# EAGLE design Gaga_Soundsystem (EAGLE 6.4)
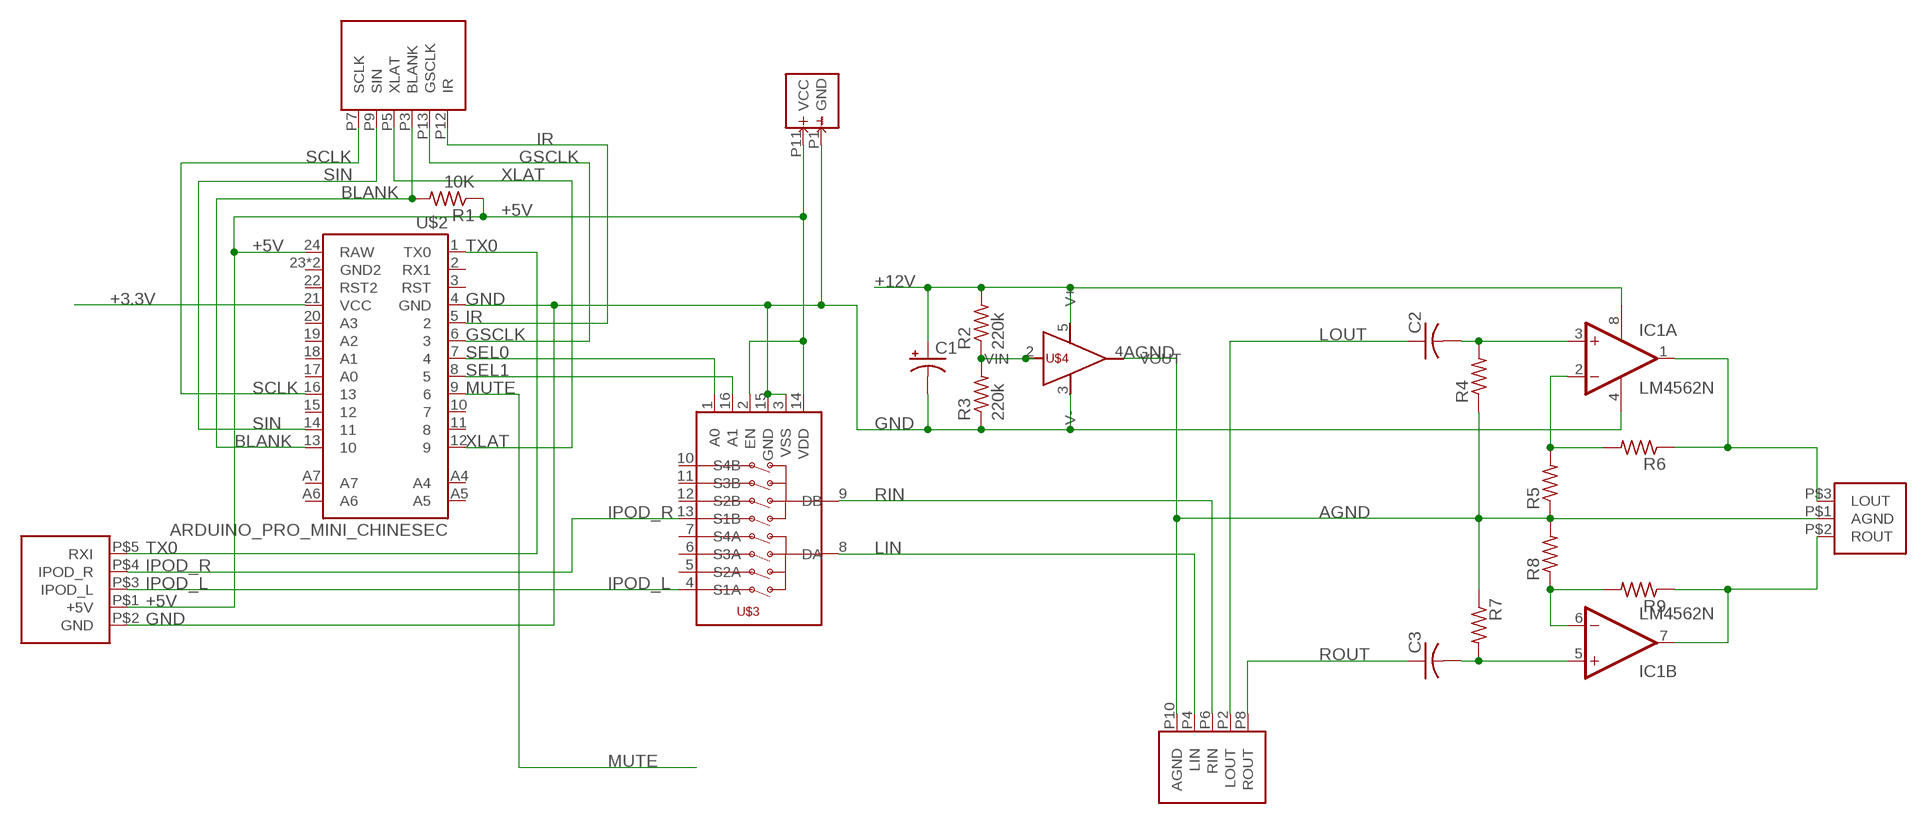
[diagram p0: schematic, sheet 1]

## Parts
C1  CPOL-USE5-13  [E5-13]
C2  C-US075-063X106  [C075-063X106]
C3  C-US075-063X106  [C075-063X106]
IC1  LM4562N  [DIL08]
R1  10K  R-US_0207/7  [0207/7]
R2  220k  R-US_0207/7  [0207/7]
R3  220k  R-US_0207/7  [0207/7]
R4  R-US_0207/7  [0207/7]
R5  R-US_0207/7  [0207/7]
R6  R-US_0207/7  [0207/7]
R7  R-US_0207/7  [0207/7]
R8  R-US_0207/7  [0207/7]
R9  R-US_0207/7  [0207/7]
U$1  OTHERSIDE  [OTHERSIDE]
U$2  ARDUINO_PRO_MINI_CHINESEC  [ARDUINO_PRO_MINI_CHINESE]
U$3  ADG709  [TSSOP16]
U$4  BUF634  [TO220]
U$5  IPODCON  [IPODCON]
U$6  AUDIOOUT  [AUDIOOUT]

## Nets
+3.3V: U$2.21(VCC)
+5V: R1.1 U$1.P11(VCC) U$2.24(RAW) U$3.2(EN) U$3.14(VDD) U$5.P$1(+5V)
+12V: C1.+ IC1.8(P:V+) R2.2 U$4.5(V+)
AGND: R4.1 R5.1 R7.1 R8.2 U$1.P10(AGND) U$4.4(VOUT) U$6.P$1(AGND)
BLANK: R1.2 U$1.P3(BLANK) U$2.13
GND: C1.- IC1.4(P:V-) R3.1 U$1.P1(GND) U$2.4(GND) U$3.3(VSS) U$3.15(GND) U$4.3(V-) U$5.P$2(GND)
GSCLK: U$1.P13(GSCLK) U$2.6
IPOD_L: U$3.4(S1A) U$5.P$3(IPOD_L)
IPOD_R: U$3.13(S1B) U$5.P$4(IPOD_R)
IR: U$1.P12(IR) U$2.5
LIN: U$1.P4(LIN) U$3.8(DA)
LOUT: C2.1 U$1.P2(LOUT)
MUTE: U$2.9
N$1: R2.1 R3.2 U$4.2(VIN)
N$8: IC1.2(A:-IN) R5.2 R6.2
N$9: C2.2 IC1.3(A:+IN) R4.2
N$10: IC1.6(B:-IN) R8.1 R9.2
N$13: IC1.1(A:OUT) R6.1 U$6.P$3(LOUT)
N$14: C3.2 IC1.5(B:+IN) R7.2
N$15: IC1.7(B:OUT) R9.1 U$6.P$2(ROUT)
RIN: U$1.P6(RIN) U$3.9(DB)
ROUT: C3.1 U$1.P8(ROUT)
SCLK: U$1.P7(SCLK) U$2.16
SEL0: U$2.7 U$3.1(A0)
SEL1: U$2.8 U$3.16(A1)
SIN: U$1.P9(SIN) U$2.14
TX0: U$2.1(TX0) U$5.P$5(RXI)
XLAT: U$1.P5(XLAT) U$2.12
Unconnected: U$2.2(RX1) U$2.3(RST) U$2.10 U$2.11 U$2.15 U$2.17(A0) U$2.18(A1) U$2.19(A2) U$2.20(A3) U$2.22(RST2) U$2.23(GND2) U$2.A4 U$2.A5 U$2.A6 U$2.A7 U$2.GND2 U$3.5(S2A) U$3.6(S3A) U$3.7(S4A) U$3.10(S4B) U$3.11(S3B) U$3.12(S2B)

## Library data of the parts
C1 = resistor:CPOL-US: POLARIZED CAPACITOR, American symbol
C2 C3 = resistor:C-US: CAPACITOR, American symbol
IC1 = LM4562:LM4562: OP AMP also LM158; LM258; LM2904 Source: http://cache.national.com/ds/LM/LM158.pdf
R1-R9 = resistor:R-US_: RESISTOR, American symbol
U$1 = connector:OTHERSIDE
U$2 = SparkFun-Boards:ARDUINO_PRO_MINI_CHINESE
U$3 = ADG709:ADG709
U$4 = BUF634:BUF634
U$5 = connector:IPODCON
U$6 = connector:AUDIOOUT

## Net classes
0 default: clearance 0.355 mm

## Board
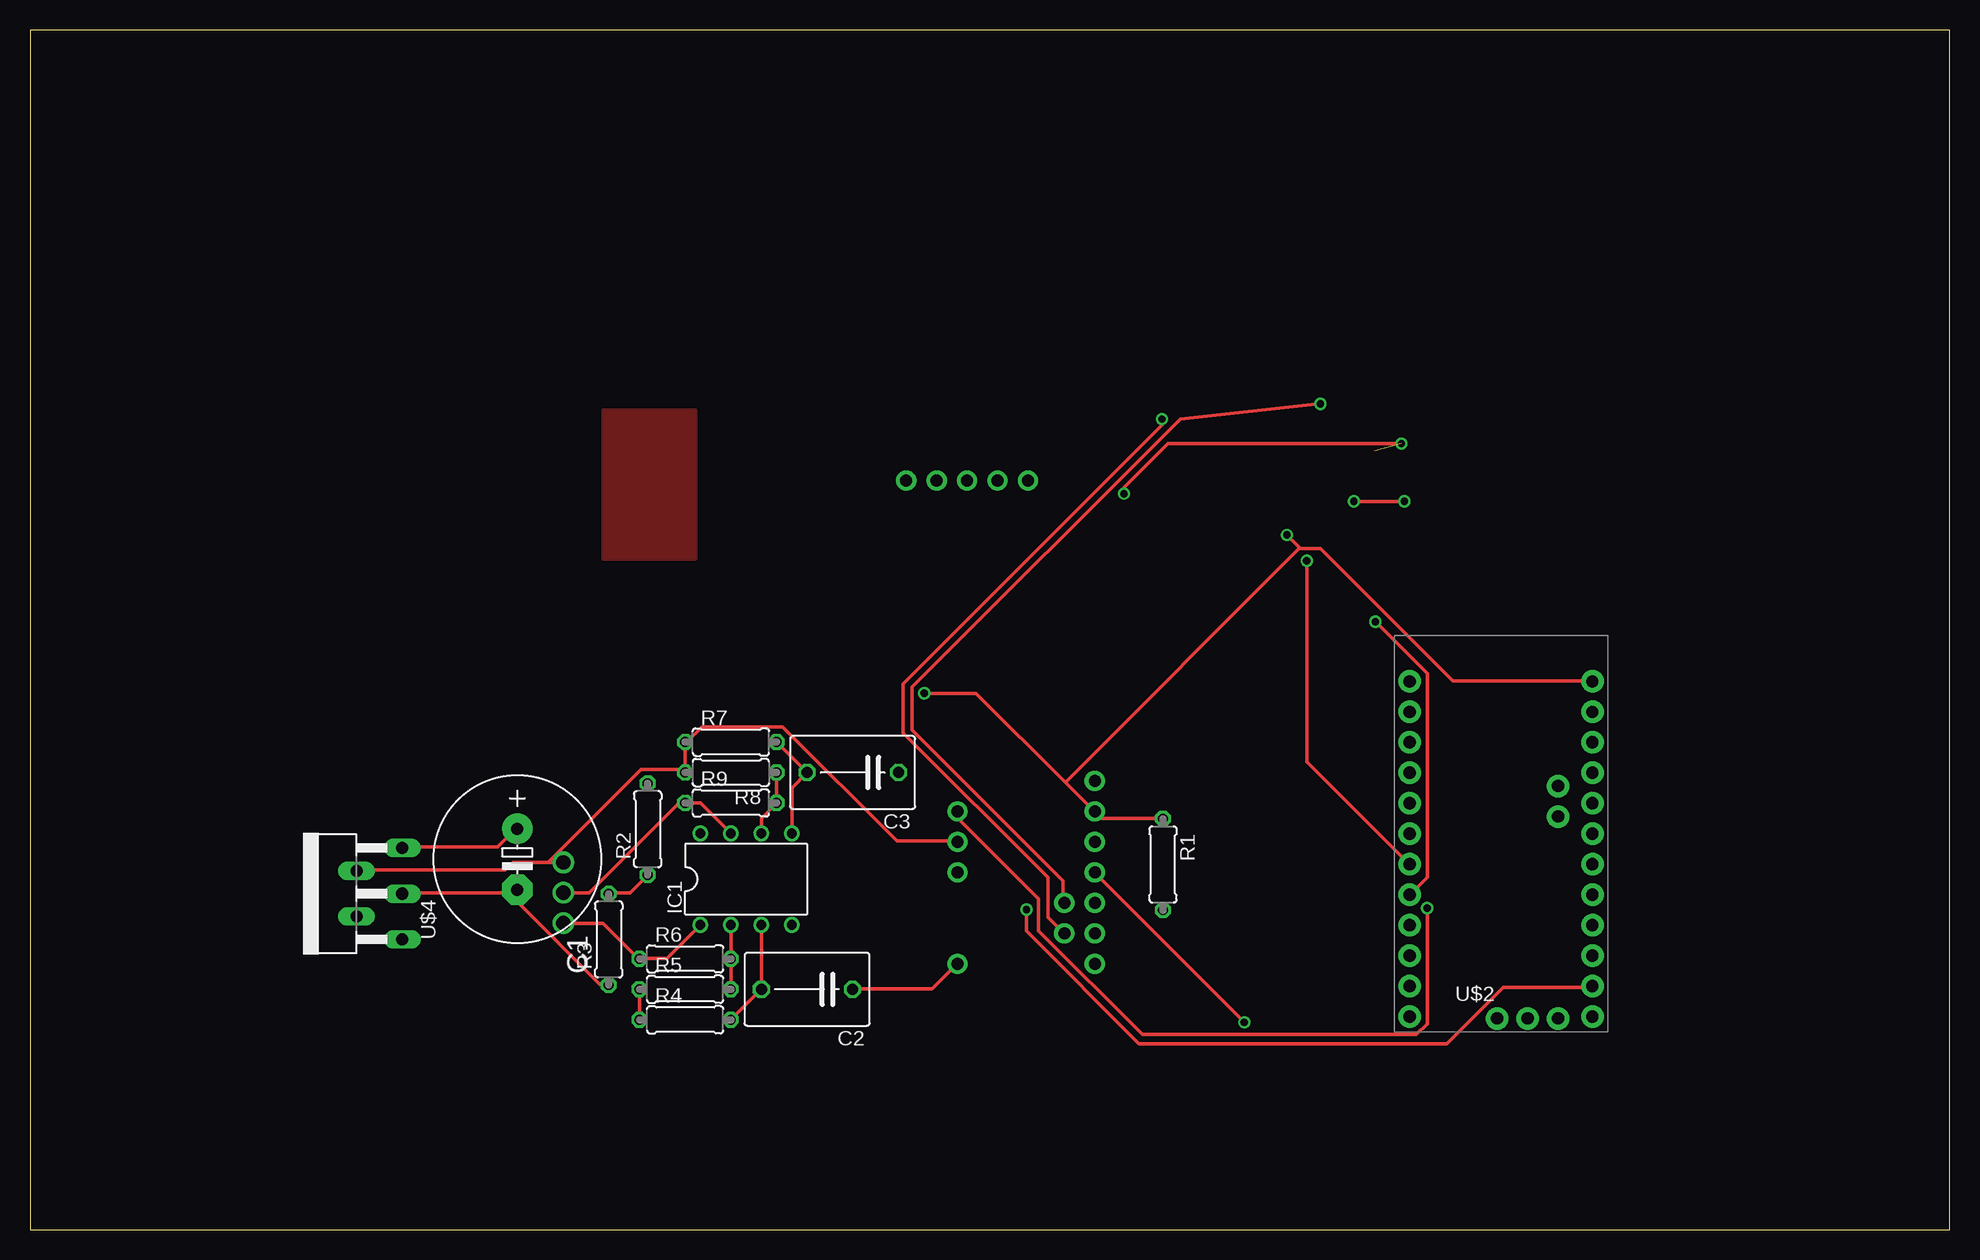
[diagram p1: board, top side]
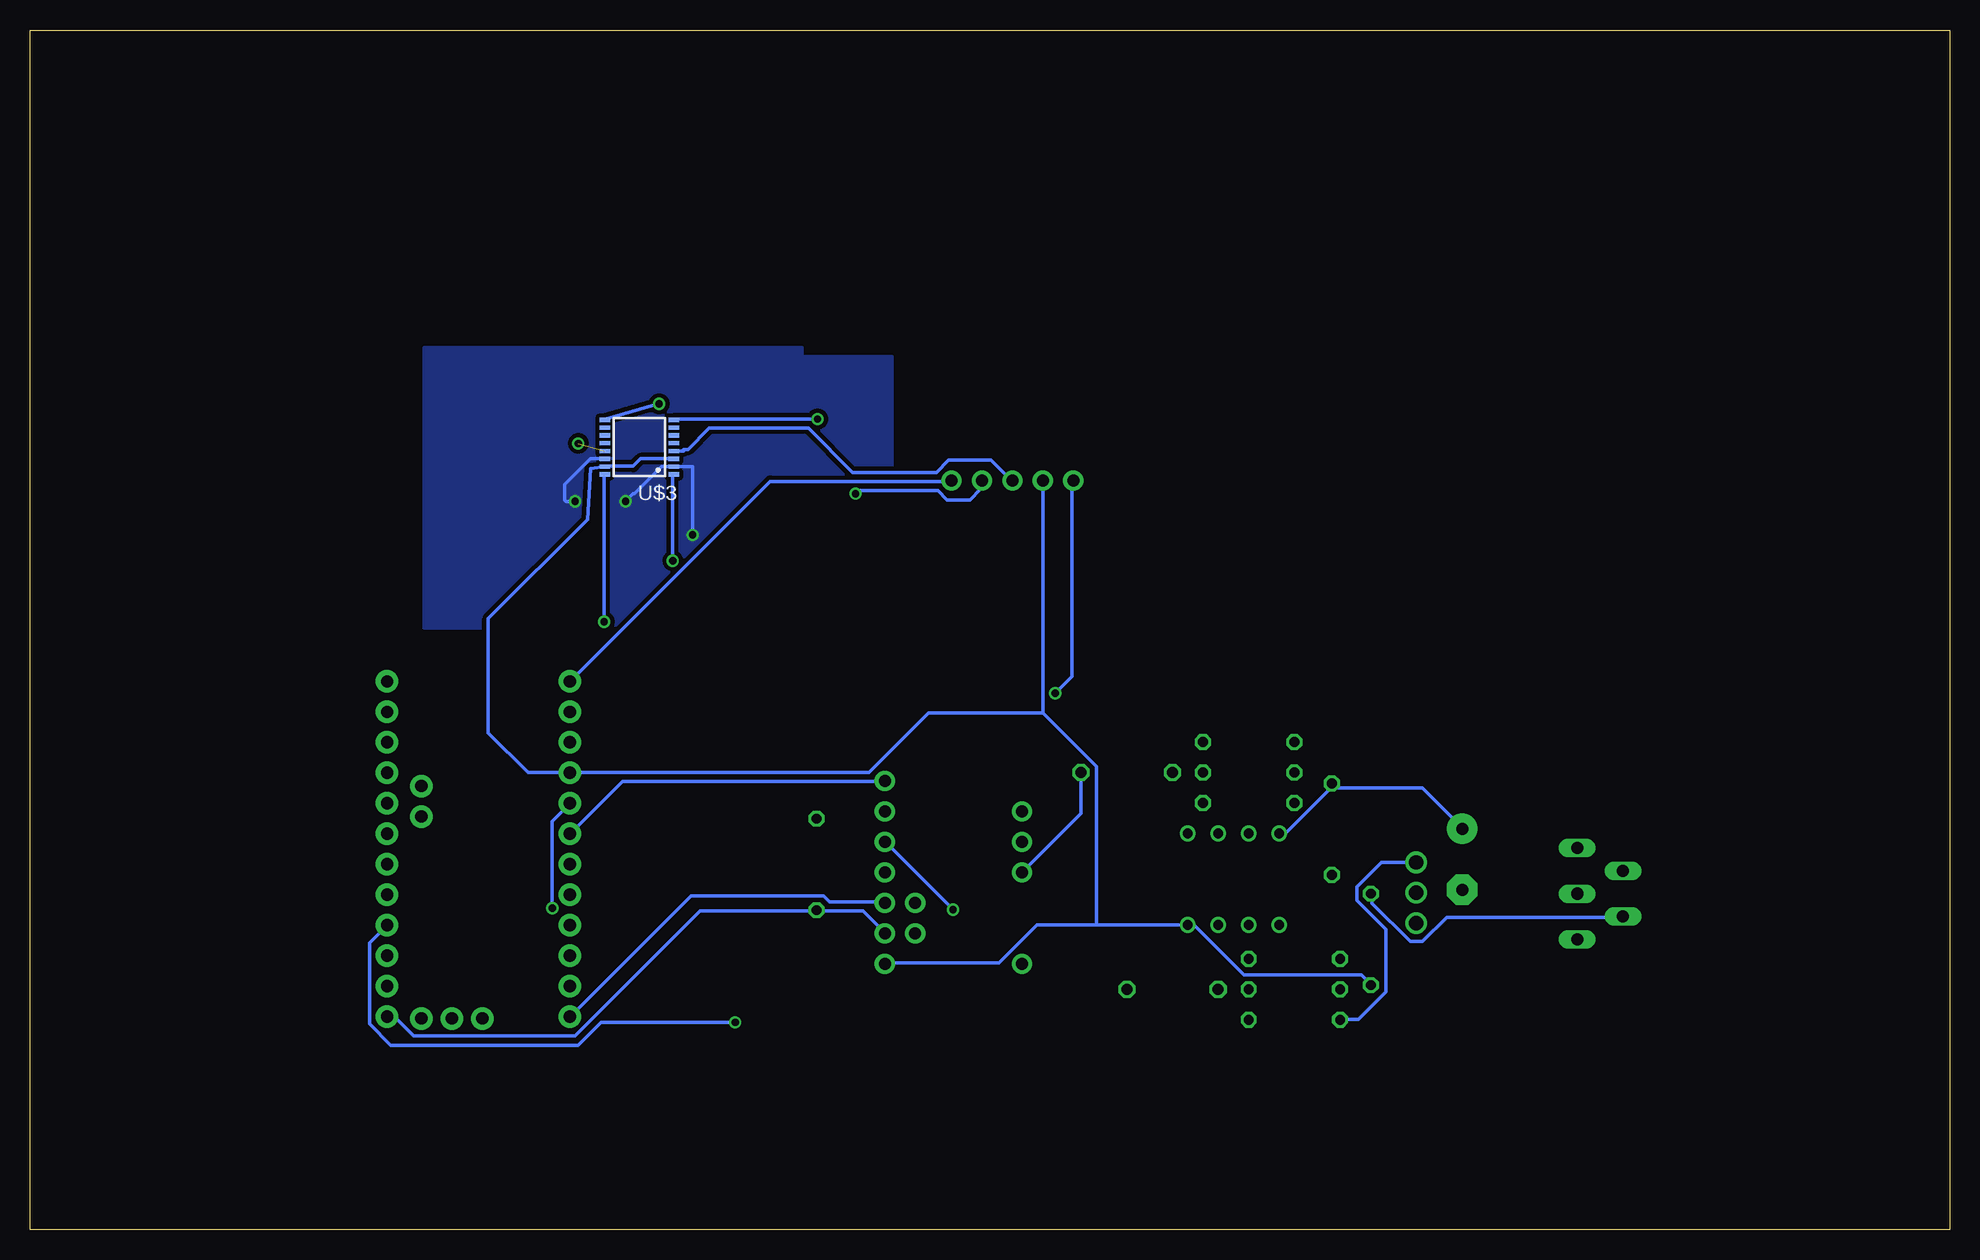
[diagram p2: board, bottom side, seen from below]

Size 160 x 100 mm. Coordinates in mm from the lower left corner, seen from the top.
Outline: 0,0 160,0 160,100 0,100 0,0
Copper layers (1*16): Top 0.035mm / dielectric 1.5mm / Bottom 0.035mm
Design rules "default *": minimum track width 12mil, minimum drill 24mil, track to track 12mil, track to pad 8mil, pad to pad 8mil, via to via 8mil, smd to smd 8mil, copper to edge 40mil, drill to drill 8mil, minimum pad ring 10mil, minimum via ring 8mil, stop-mask expansion 4mil, vias tented up to drill 0mil, thermal gap 10mil

### Footprints (pad centres in the part's own frame; a part is rotated, then mirrored left to right if it is on the bottom)
E5-13 = drill 1.016 pad 2.54: + -2.54,0 | drill 1.016 pad 2.54 octagon: - 2.54,0
C075-063X106 = drill 0.914 octagon: 1 -3.81,0; 2 3.81,0
DIL08 = drill 0.813 pad 1.27: 1 -3.81,-3.81; 2 -1.27,-3.81; 3 1.27,-3.81; 4 3.81,-3.81; 5 3.81,3.81; 6 1.27,3.81; 7 -1.27,3.81; 8 -3.81,3.81
0207/7 = drill 0.813 octagon: 1 -3.81,0; 2 3.81,0
OTHERSIDE = drill 1 pad 1.676: P1 1.27,10.16; P2 1.27,-1.27; P3 -1.27,10.16; P4 -1.27,7.62; P5 -3.81,10.16; P6 -3.81,7.62; P7 -6.35,10.16; P8 -6.35,-1.27; P9 -8.89,10.16; P10 -8.89,-1.27; P11 -11.43,10.16; P12 -11.43,-1.27; P13 -13.97,10.16
ARDUINO_PRO_MINI_CHINESE = drill 1.016 pad 1.88: 1 -7.62,12.7; 2 -7.62,10.16; 3 -7.62,7.62; 4 -7.62,5.08; 5 -7.62,2.54; 6 -7.62,0; 7 -7.62,-2.54; 8 -7.62,-5.08; 9 -7.62,-7.62; 10 -7.62,-10.16; 11 -7.62,-12.7; 12 -7.62,-15.24; 13 7.62,-15.24; 14 7.62,-12.7; 15 7.62,-10.16; 16 7.62,-7.62; 17 7.62,-5.08; 18 7.62,-2.54; 19 7.62,0; 20 7.62,2.54; 21 7.62,5.08; 22 7.62,7.62; 23 7.62,10.16; 24 7.62,12.7; A4 4.763,1.429; A5 4.763,3.969; A6 2.223,-15.399; A7 4.763,-15.399; GND2 -0.318,-15.399
TSSOP16 = smd 0.9 x 0.35: 1 -2.875,2.275; 2 -2.875,1.625; 3 -2.875,0.975; 4 -2.875,0.325; 5 -2.875,-0.325; 6 -2.875,-0.975; 7 -2.875,-1.625; 8 -2.875,-2.275; 9 2.875,-2.275; 10 2.875,-1.625; 11 2.875,-0.975; 12 2.875,-0.325; 13 2.875,0.325; 14 2.875,0.975; 15 2.875,1.625; 16 2.875,2.275
TO220 = drill 1.016 long: 1 -3.81,-8.255; 2 -1.905,-4.445; 3 0,-8.255; 4 1.905,-4.445; 5 3.81,-8.255
IPODCON = drill 1 pad 1.676: P$1 -5.08,0; P$2 -2.54,0; P$3 0,0; P$4 2.54,0; P$5 5.08,0
AUDIOOUT = drill 1.2: P$1 -2.54,0; P$2 0,0; P$3 2.54,0

### Placement (x,y rotation side)
C1  40.62,30.86 270 top
C2  64.77,20.02 180 top
C3  68.58,38.1 180 top
IC1  59.69,29.21 0 top
R1  94.44,30.43 270 top
R2  51.48,33.38 90 top
R3  48.23,24.19 90 top
R4  54.61,17.48 0 top
R5  54.61,20.02 0 top
R6  54.61,22.57 0 top
R7  58.42,40.64 0 top
R8  58.42,38.1 180 top
R9  58.42,35.56 0 top
U$1  78.59,23.42 270 top
U$2  122.61,33 0 top
U$3  109.21,65.23 180 bottom
U$4  22.77,28 90 top
U$5  78.12,62.44 0 top
U$6  44.45,28.07 270 top

### Tracks (layer width: path | path; a pad name or v marks a point on that pad's centre or on a via)
+5V  (via drill 0.6, 0.61)
  Top 0.305: R1.1 94.36,34.29 89.28,34.29 88.77,34.8 U$1.P11 88.65,34.92 86.3,37.27 | v74.55,44.7 78.87,44.7 86.3,37.27 | 105.79,56.77 107.57,56.77 118.62,45.72 130.18,45.72 U$2.24 | 86.3,37.27 105.79,56.77 | v104.78,57.91 105.79,56.9 105.79,56.77 | v110.36,60.71 v114.55,60.71
  Bottom 0.305: v74.55,44.7 73.15,46.1 73.15,62.36 U$5.P$1 | v104.78,57.91 104.78,63.6 U$3.2 107.34,63.6 109.6,61.34 109.73,61.34 v110.36,60.71 | U$3.14 113.29,64.25 115.44,62.1 115.44,60.83 115.32,60.71 v114.55,60.71
  pour Bottom: 95.38,72.77 88.14,72.77 88.14,50.16 127.13,50.16 127.13,73.53 95.63,73.53 95.63,72.77
+12V
  Top 0.305: U$4.5 31.11,31.88 38.99,31.88 40.51,33.4 C1.+
  Bottom 0.305: IC1.8 55.37,33.02 51.56,36.83 51.56,37.08 R2.2 51.44,36.83 43.94,36.83 40.64,33.53 C1.+
AGND
  Top 0.305: U$1.P10 77.22,32.38 72.26,32.38 62.74,41.91 56.01,41.91 54.74,40.64 R7.1 R8.2 54.48,38.35 50.93,38.35 43.31,30.73 43.31,30.61 | R5.1 R4.1 | U$6.P$1 43.31,30.61 | 43.31,30.61 40.26,30.61 39.62,29.97 27.3,29.97 U$4.4
  Bottom 0.305: U$6.P$1 47.37,30.61 49.4,28.57 49.4,27.43 46.99,25.02 46.99,19.81 49.28,17.53 50.8,17.53 R4.1
BLANK
  Bottom 0.305: U$1.P3 88.77,24.77 90.55,26.54 94.36,26.54 R1.2 94.49,26.54 104.14,26.54 114.55,16.13 128.02,16.13 129.54,17.65 130.18,17.65 U$2.13
GND
  Top 0.305: R3.1 48.13,20.45 47.5,20.45 40.64,27.3 40.64,28.32 C1.- 40.51,28.07 31.11,28.07 U$4.3
  Bottom 0.305: R3.1 48.26,20.45 49.02,21.21 58.8,21.21 62.99,25.4 IC1.4 71.12,25.4 | 71.12,25.4 76.07,25.4 79.25,22.23 88.65,22.23 U$1.P1 | 75.56,43.05 75.56,62.36 U$5.P$2 | 75.56,43.05 71.12,38.61 71.12,25.4 | 114.94,38.1 90.04,38.1 85.09,43.05 75.56,43.05 | 114.94,38.1 U$2.4 | U$3.3 arc-90 U$3.3 109.09,64.26 109.73,63.63 112.08,63.63 U$3.15 113.28,63.42 113.54,59.18 121.79,50.93 121.79,41.4 118.49,38.1 114.94,38.1
GSCLK
  Bottom 0.305: U$1.P13 88.77,37.34 110.62,37.34 114.94,33.02 U$2.6
IPOD_L
  Bottom 0.305: U$5.P$3 78.23,62.48 79.88,64.14 83.44,64.14 84.45,63.12 91.44,63.12 95.12,66.8 103.38,66.8 105.16,65.02 105.54,65.02 105.54,64.9 106.33,64.9 U$3.4
IPOD_R  (via drill 0.6)  (1 unrouted)
  Top 0.305: v114.3,65.53 94.87,65.53 91.19,61.85 v91.19,61.34
  Bottom 0.305: v91.19,61.34 90.93,61.59 84.33,61.59 83.57,60.83 81.66,60.83 80.77,61.72 80.77,62.36 U$5.P$4
IR  (via drill 0.61)
  Top 0.305: v116.46,26.8 116.46,17.14 115.57,16.26 92.71,16.26 84.07,24.89 84.07,27.56 77.34,34.29 77.34,34.8 U$1.P12
  Bottom 0.305: v116.46,26.8 116.46,34.04 115.06,35.43 U$2.5
L
  pour Top (rank 2): 55.5,68.33 47.75,68.33 47.75,55.88 55.5,55.88
LIN  (via drill 0.61)
  Top 0.305: v94.36,67.56 94.36,67.06 72.77,45.47 72.77,41.4 84.84,29.34 84.84,26.04 86.11,24.77 U$1.P4
  Bottom 0.305: v94.36,67.56 106.3,67.56 U$3.8
LOUT
  Top 0.305: C2.1 68.58,20.07 75.18,20.07 77.22,22.1 U$1.P2
N$1
  Top 0.305: R3.2 48.26,28.07 50.04,28.07 51.44,29.46 R2.1
  Bottom 0.305: U$4.2 27.3,26.04 41.91,26.04 43.94,24 44.96,24 48.13,27.18 48.13,27.94 R3.2
N$8
  Top 0.305: R5.2 R6.2 IC1.2
N$9
  Top 0.305: R4.2 58.42,17.53 60.96,20.07 C2.2 IC1.3
N$10
  Top 0.305: IC1.6 60.96,34.29 R9.2 R8.1
N$13
  Top 0.305: IC1.1 53.09,22.61 50.8,22.61 R6.1 50.67,22.61 47.75,25.53 U$6.P$3
N$14
  Top 0.305: IC1.5 63.5,36.83 C3.2 R7.2
N$15
  Top 0.305: IC1.7 55.88,35.56 R9.1 54.1,35.56 46.61,28.07 U$6.P$2
RIN  (via drill 0.61)
  Top 0.305: v107.57,68.83 95.89,67.56 73.53,45.21 73.53,41.66 86.11,29.08 86.11,27.3 U$1.P6
  Bottom 0.305: v107.57,68.83 112.01,67.56 U$3.9
ROUT
  Bottom 0.305: C3.1 72.39,34.67 77.22,29.84 U$1.P8
SCLK  (via drill 0.61)
  Top 0.305: v101.22,17.27 88.77,29.72 U$1.P7
  Bottom 0.305: v101.22,17.27 112.39,17.27 114.3,15.37 129.92,15.37 131.7,17.14 131.7,23.88 130.3,25.27 U$2.16
SEL0  (via drill 0.61)
  Top 0.305: v106.43,55.75 106.43,38.99 114.94,30.48 U$2.7
  Bottom 0.305: v106.43,55.75 106.43,62.87 U$3.1
SEL1  (via drill 0.61)
  Top 0.305: v112.14,50.67 116.46,46.35 116.46,29.34 115.06,27.94 U$2.8
  Bottom 0.305: v112.14,50.67 112.14,62.87 U$3.16
SIN  (via drill 0.61)
  Top 0.305: v83.06,26.67 83.06,24.89 92.46,15.49 118.11,15.49 122.81,20.19 130.18,20.19 U$2.14
  Bottom 0.305: v83.06,26.67 88.65,32.26 U$1.P9
TX0
  Bottom 0.305: U$5.P$5 83.31,62.36 98.3,62.36 114.94,45.72 U$2.1
XLAT
  Bottom 0.305: U$1.P5 88.77,27.3 93.34,27.3 93.85,27.81 104.9,27.81 114.94,17.78 U$2.12